# Altium schematic sheet Other.SchDoc
size A3; SheetNumber: 2; SheetTotal: 2
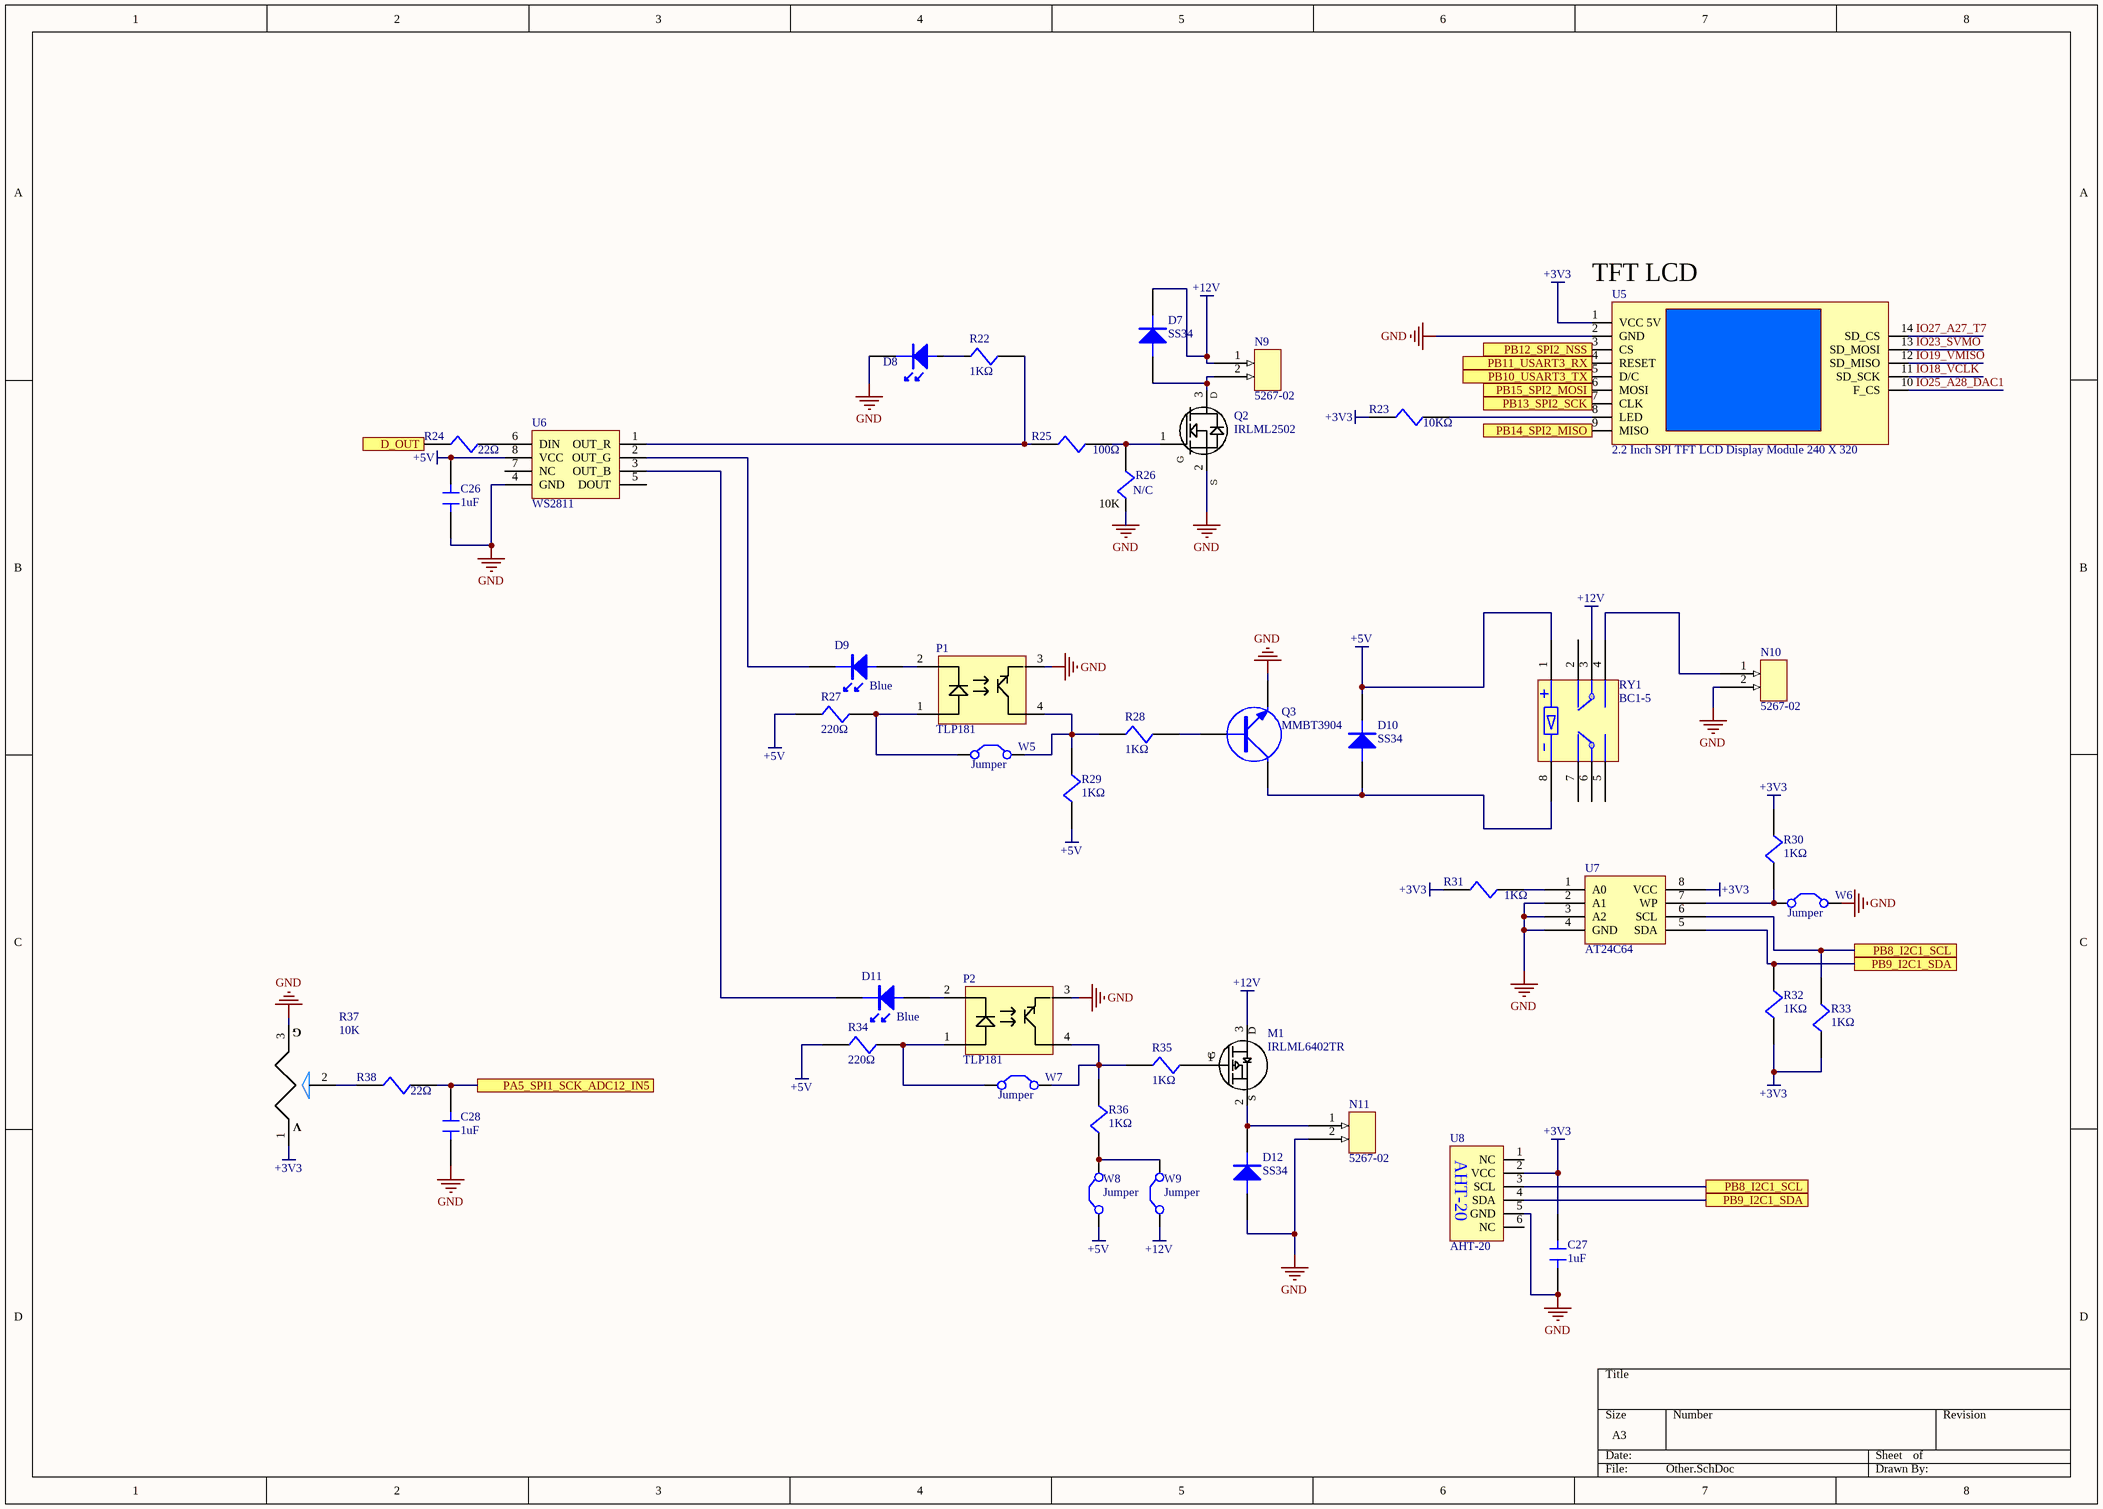
[diagram p0: Other.SchDoc]

## Parts
C26  Part Number: 1uF  [1608-C]  (hidden comment: Chip Capacitor)
C27  Part Number: 1uF  [1608-C]  (hidden comment: Chip Capacitor)
C28  Part Number: 1uF  [1608-C]  (hidden comment: Chip Capacitor)
D7  DIODE  [SS34]  (value not drawn)
D8  LED  [1608-LED]  (value not drawn)
D9  Part Number: Blue  [1608-LED]  (hidden comment: Chip LED)
D10  DIODE  [SS34]  (value not drawn)
D11  Part Number: Blue  [1608-LED]  (hidden comment: Chip LED)
D12  DIODE  [SS34]  (value not drawn)
M1  Part Number: IRLML6402TR  [Micro3]  (hidden comment: MOSPET-P)
N9  CONNECTOR  [5267-02]  (value not drawn)
N10  CONNECTOR  [5267-02]  (value not drawn)
N11  CONNECTOR  [5267-02]  (value not drawn)
P1  Photo_Coupler  [TLP181]  (value not drawn)
P2  Photo_Coupler  [TLP181]  (value not drawn)
Q2  N_FET  [SOT_23_BIG]  (value not drawn)
Q3  Part Number: MMBT3904  [SOT-23TR]  (hidden comment: NPN TR)
R22  Part Number: 1KΩ  [1608-R]  (hidden comment: Chip Resistor)
R23  Part Number: 10KΩ  [1608-R]  (hidden comment: Chip Resistor)
R24  Part Number: 22Ω  [1608-R]  (hidden comment: Chip Resistor)
R25  Part Number: 100Ω  [1608-R]  (hidden comment: Chip Resistor)
R26  Part Number: N/C  [1608-R]  (hidden comment: Chip Resistor)
R27  Part Number: 220Ω  [1608-R]  (hidden comment: Chip Resistor)
R28  Part Number: 1KΩ  [1608-R]  (hidden comment: Chip Resistor)
R29  Part Number: 1KΩ  [1608-R]  (hidden comment: Chip Resistor)
R30  Part Number: 1KΩ  [1608-R]  (hidden comment: Chip Resistor)
R31  Part Number: 1KΩ  [1608-R]  (hidden comment: Chip Resistor)
R32  Part Number: 1KΩ  [1608-R]  (hidden comment: Chip Resistor)
R33  Part Number: 1KΩ  [1608-R]  (hidden comment: Chip Resistor)
R34  Part Number: 220Ω  [1608-R]  (hidden comment: Chip Resistor)
R35  Part Number: 1KΩ  [1608-R]  (hidden comment: Chip Resistor)
R36  Part Number: 1KΩ  [1608-R]  (hidden comment: Chip Resistor)
R37  10K  [RES_POT_RV12V-15RS]
R38  Part Number: 22Ω  [1608-R]  (hidden comment: Chip Resistor)
RY1  Part Number: BC1-5  [RELAY_BC1]  (hidden comment: Relay)
U5  Part Number: 2.2 Inch SPI TFT LCD Display Module 240 X 320  [LCD_TFT_2.2]  (hidden comment: TFT LCD)
U6  Driver  [SOP-08_mini]  (value not drawn)
U7  AT24C64  [SOIC-8]
U8  Sensor  [AHT-20]  (value not drawn)
W5  Jumper  [jp]
W6  Jumper  [jp]
W7  Jumper  [jp]
W8  Jumper  [jp]
W9  Jumper  [jp]

## Ports
D_OUT, PA5_SPI1_SCK_ADC12_IN5, PB8_I2C1_SCL, PB9_I2C1_SDA, PB10_USART3_TX, PB11_USART3_RX, PB12_SPI2_NSS, PB13_SPI2_SCK, PB14_SPI2_MISO, PB15_SPI2_MOSI

## Nets
+3V3: C27.2 R23.1 R30.2 R31.1 R32.1 R33.1 R37.1 U5.1(VCC_5V) U7.8(VCC) U8.2(VCC)
+5V: C26.1 D10.2(K) R27.2 R29.2 R34.2 RY1.1 U6.8(VCC) W8.1(C1)
+12V: D7.2(K) M1.3(D) N9.1 RY1.3 W9.1(C1)
GND: C26.2 C27.1 C28.2 D8.2 D12.1(A) N10.2 N11.2 P1.3 P2.3 Q2.2 Q3.3(E) R26.1 R37.3 U5.2(GND) U6.4(GND) U7.2(A1) U7.3(A2) U7.4(GND) U8.5(GND) W6.2(C2)
D_OUT: R24.2 ; port D_OUT
IO18_VCLK: U5.11(SD_SCK)
IO19_VMISO: U5.12(SD_MISO)
IO23_SVMO: U5.13(SD_MOSI)
IO25_A28_DAC1: U5.10(F_CS)
IO27_A27_T7: U5.14(SD_CS)
PA5_SPI1_SCK_ADC12_IN5: C28.1 R38.1 ; port PA5_SPI1_SCK_ADC12_IN5
PB8_I2C1_SCL: R33.2 U7.6(SCL) U8.3(SCL) ; port PB8_I2C1_SCL
PB9_I2C1_SDA: R32.2 U7.5(SDA) U8.4(SDA) ; port PB9_I2C1_SDA
PB10_USART3_TX: U5.5(D/C) ; port PB10_USART3_TX
PB11_USART3_RX: U5.4(RESET) ; port PB11_USART3_RX
PB12_SPI2_NSS: U5.3(CS) ; port PB12_SPI2_NSS
PB13_SPI2_SCK: U5.7(CLK) ; port PB13_SPI2_SCK
PB14_SPI2_MISO: U5.9(MISO) ; port PB14_SPI2_MISO
PB15_SPI2_MOSI: U5.6(MOSI) ; port PB15_SPI2_MOSI
NetD7_1: D7.1(A) N9.2 Q2.3
NetD8_1: D8.1 R22.2
NetD9_1: D9.1 P1.2
NetD9_2: D9.2 U6.2(OUT_G)
NetD10_1: D10.1(A) Q3.2(C) RY1.8
NetD11_1: D11.1 P2.2
NetD11_2: D11.2 U6.3(OUT_B)
NetD12_2: D12.2(K) M1.2(S) N11.1
NetM1_1: M1.1(G) R35.2
NetN10_1: N10.1 RY1.4
NetP1_1: P1.1 R27.1 W5.1(C1)
NetP1_4: P1.4 R28.1 R29.1 W5.2(C2)
NetP2_1: P2.1 R34.1 W7.1(C1)
NetP2_4: P2.4 R35.1 R36.1 W7.2(C2)
NetQ2_1: Q2.1 R25.2 R26.2
NetQ3_1: Q3.1(B) R28.2
NetR22_1: R22.1 R25.1 U6.1(OUT_R)
NetR23_2: R23.2 U5.8(LED)
NetR24_1: R24.1 U6.6(DIN)
NetR30_1: R30.1 U7.7(WP) W6.1(C1)
NetR31_2: R31.2 U7.1(A0)
NetR36_2: R36.2 W8.2(C2) W9.2(C2)
NetR37_2: R37.2 R38.2

Not connected (* = marked no-connect by the designer): RY1 2 5 6 7; U6 5(DOUT) 7(NC); U8 1(NC) 6(NC)

## Notes on the sheet
- (near U5) TFT LCD
- (near R26) 10K
- (in symbol IRLML2502) D; G; S
- (in symbol RES-POT) G; V

## Library data of the parts
C26-C28 = CAP: Capacitor, 1608 type; LCSC: C15849
D8 = LED: Green, 1608. SMD
D9 D11 = LED: 1608 Chip LED; LCSC: C118339
M1 = MOSPET-P: P-Channel MOSFET; Temp: -55 ~ +150; URL: http://www.devicemart.co.kr/3594; LCSC: C3034
N9-N11 = CON2: Molex; Part Number: 5267-02
P1 P2 = Photo_Coupler: 1CH_small coupler; Temp: -55 ~ +125; Maker: TOSHIBA; Part Number: TLP181; LCSC: C388374
Q2 = IRLML2502: N Chnel FET; URL: http://www.devicemart.co.kr/goods/view?no=5829#goods_file; Part Number: IRLML2502
Q3 = TR(NPN): Transistor; LCSC: C20526
R22 R23 R25-R36 = RES1: Resistor, 1608 type
  R27 R34: LCSC: C22962
  R28 R29 R31-R33 R35 R36: LCSC: C21190
  R30: LCSC: NC
R24 R38 = RES1: Resistor, 1608 type; Value: 10KΩ; LCSC: C1203
R37 = RES-POT: RV09H-20SQ 10KΩ
RY1 = RELAY: 5V, dual, DIP
U5 = LCD_TFT_2.2: TFT 2.2 LCD 320 X 240
U6 = WS2811: PWM Driver; LCSC: C114581; Temp: =22 ~ 85; URL: https://cdn-shop.adafruit.com/datasheets/WS2811.pdf; Part Number: WS2811
U8 = AHT-20: Temperature and Humidity sensor; ComponentLink1Description: URL; ComponentLink1URL: https://files.seeedstudio.com/wiki/Grove-AHT20_I2C_Industrial_Grade_Temperature_and_Humidity_Sensor/AHT20-datasheet-2020-4-16.pdf; LCSC: NC; Part Number: AHT-20
W5-W9 = Jumper: Jumper Wire; Part Number: NC; Published: 24-Mar-1999; LatestRevisionDate: 17-Jul-2002; LatestRevisionNote: Re-released for DXP Platform.; PackageReference: RAD-0.2; Publisher: Altium Limited; PackageDescription: Radial Cap, Thru-Hole; 2 Leads; 0.2 in Pin Spacing
D7 D10 D12 = DIODE: Part Number: SS34; LCSC: C8678
U7 = AT24C64: LCSC: C6487